# EAGLE design 8relays (EAGLE 6.4)
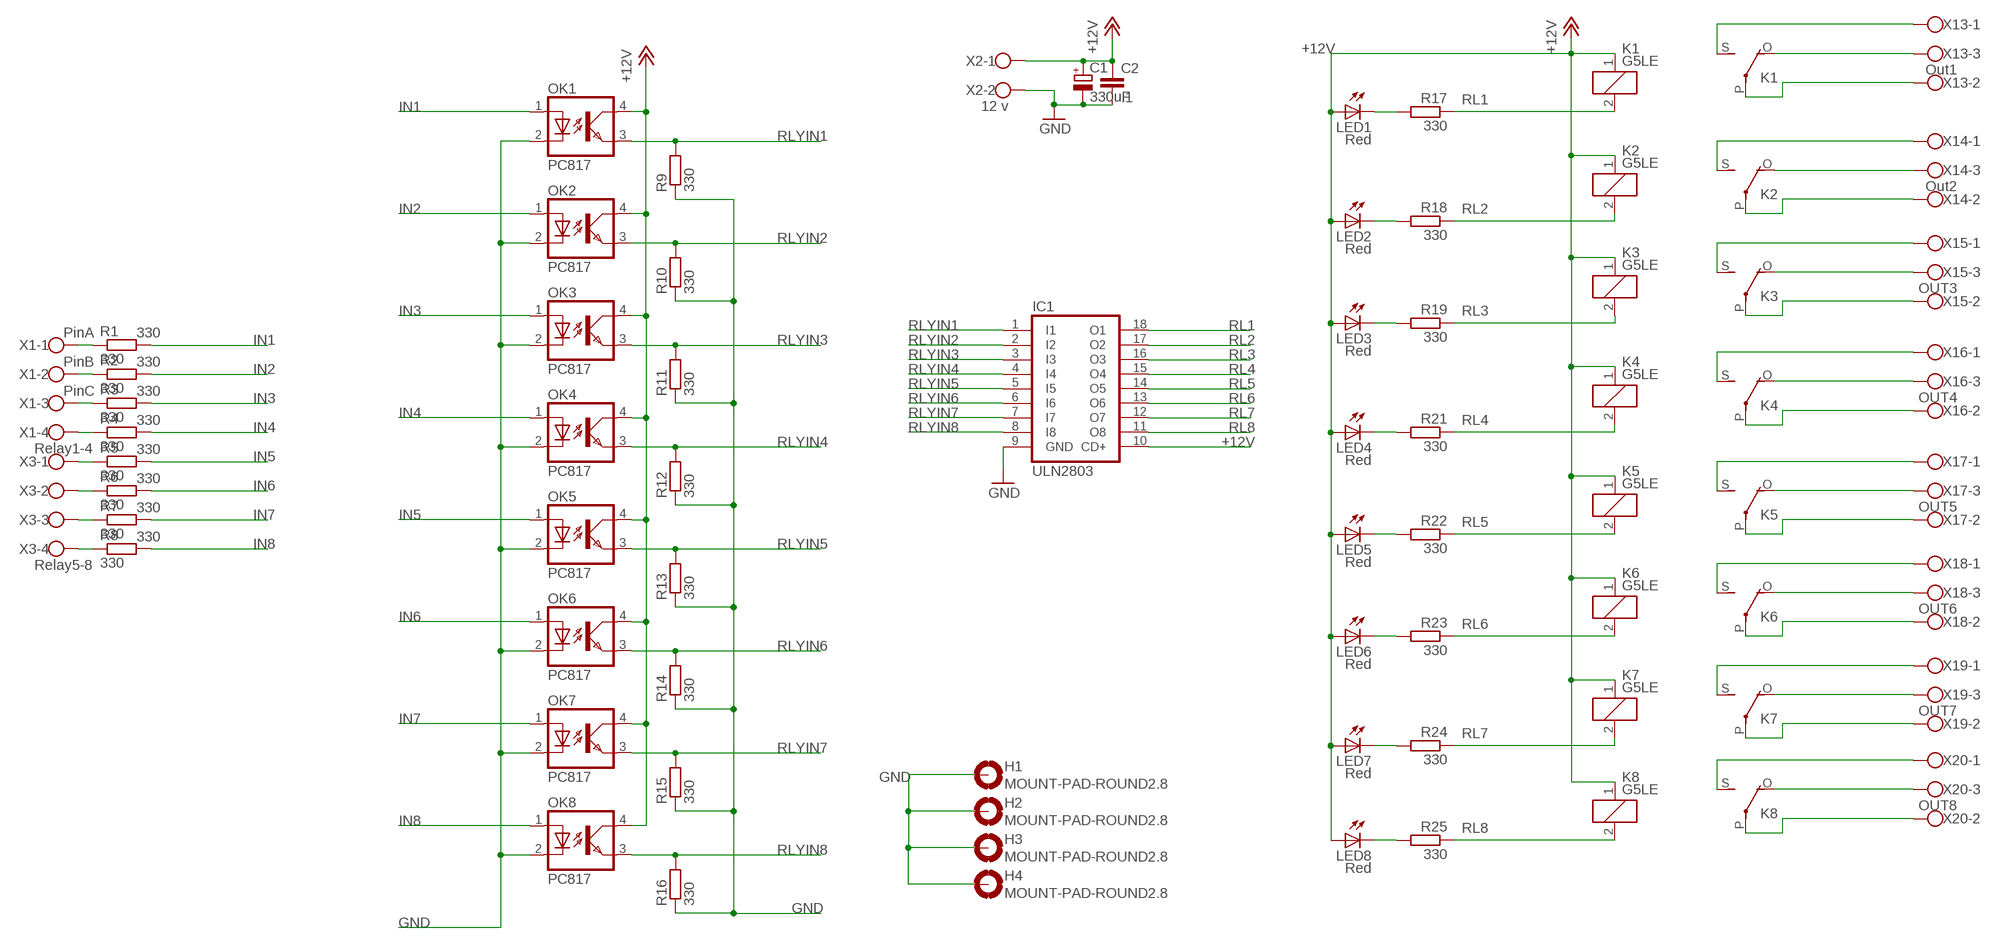
[diagram p0: schematic, sheet 1]

## Parts
C1  330uF  CPOL-EUE5-10.5  [E5-10,5]
C2  .1  C5/2.5  [C5B2.5]
H1  MOUNT-PAD-ROUND2.8  [2,8-PAD]
H2  MOUNT-PAD-ROUND2.8  [2,8-PAD]
H3  MOUNT-PAD-ROUND2.8  [2,8-PAD]
H4  MOUNT-PAD-ROUND2.8  [2,8-PAD]
IC1  ULN2803  ULN2803A  [DIL18]
K1  G5LE  [G5LE]
K2  G5LE  [G5LE]
K3  G5LE  [G5LE]
K4  G5LE  [G5LE]
K5  G5LE  [G5LE]
K6  G5LE  [G5LE]
K7  G5LE  [G5LE]
K8  G5LE  [G5LE]
LED1  Red  LED3MM  [LED3MM]
LED2  Red  LED3MM  [LED3MM]
LED3  Red  LED3MM  [LED3MM]
LED4  Red  LED3MM  [LED3MM]
LED5  Red  LED3MM  [LED3MM]
LED6  Red  LED3MM  [LED3MM]
LED7  Red  LED3MM  [LED3MM]
LED8  Red  LED3MM  [LED3MM]
OK1  PC817  [DIL04]
OK2  PC817  [DIL04]
OK3  PC817  [DIL04]
OK4  PC817  [DIL04]
OK5  PC817  [DIL04]
OK6  PC817  [DIL04]
OK7  PC817  [DIL04]
OK8  PC817  [DIL04]
R1  330  R-EU_0204/5  [0204/5]
R2  330  R-EU_0204/5  [0204/5]
R3  330  R-EU_0204/5  [0204/5]
R4  330  R-EU_0204/5  [0204/5]
R5  330  R-EU_0204/5  [0204/5]
R6  330  R-EU_0204/5  [0204/5]
R7  330  R-EU_0204/5  [0204/5]
R8  330  R-EU_0204/5  [0204/5]
R9  330  R-EU_0204/5  [0204/5]
R10  330  R-EU_0204/5  [0204/5]
R11  330  R-EU_0204/5  [0204/5]
R12  330  R-EU_0204/5  [0204/5]
R13  330  R-EU_0204/5  [0204/5]
R14  330  R-EU_0204/5  [0204/5]
R15  330  R-EU_0204/5  [0204/5]
R16  330  R-EU_0204/5  [0204/5]
R17  330  R-EU_0204/5  [0204/5]
R18  330  R-EU_0204/5  [0204/5]
R19  330  R-EU_0204/5  [0204/5]
R21  330  R-EU_0204/5  [0204/5]
R22  330  R-EU_0204/5  [0204/5]
R23  330  R-EU_0204/5  [0204/5]
R24  330  R-EU_0204/5  [0204/5]
R25  330  R-EU_0204/5  [0204/5]
X1  Relay1-4  W237-4  [W237-4]
X2  12 v  W237-102  [W237-102]
X3  Relay5-8  W237-4  [W237-4]
X13  Out1  W237-103  [W237-103]
X14  Out2  W237-103  [W237-103]
X15  OUT3  W237-103  [W237-103]
X16  OUT4  W237-103  [W237-103]
X17  OUT5  W237-103  [W237-103]
X18  OUT6  W237-103  [W237-103]
X19  OUT7  W237-103  [W237-103]
X20  OUT8  W237-103  [W237-103]

## Nets
+12V: C1.+ C2.1 IC1.10(CD+) K1.1 K2.1 K3.1 K4.1 K5.1 K6.1 K7.1 K8.1 LED1.A LED2.A LED3.A LED4.A LED5.A LED6.A LED7.A LED8.A OK1.4(COL) OK2.4(COL) OK3.4(COL) OK4.4(COL) OK5.4(COL) OK6.4(COL) OK7.4(COL) OK8.4(COL) X2.1
GND: C1.- C2.2 H1.B2,8(MOUNT) H2.B2,8(MOUNT) H3.B2,8(MOUNT) H4.B2,8(MOUNT) IC1.9(GND) OK1.2(C) OK2.2(C) OK3.2(C) OK4.2(C) OK5.2(C) OK6.2(C) OK7.2(C) OK8.2(C) R9.1 R10.1 R11.1 R12.1 R13.1 R14.1 R15.1 R16.1 X2.2
IN1: OK1.1(A) R1.2
IN2: OK2.1(A) R2.2
IN3: OK3.1(A) R3.2
IN4: OK4.1(A) R4.2
IN5: OK5.1(A) R5.2
IN6: OK6.1(A) R6.2
IN7: OK7.1(A) R7.2
IN8: OK8.1(A) R8.2
N$1: R1.1 X1.1
N$2: LED5.K(C) R22.2
N$3: K1.O(2:O) X13.3
N$4: K1.P(2:P) X13.2
N$5: R4.1 X1.4
N$6: K1.S(2:S) X13.1
N$7: R5.1 X3.1
N$8: R6.1 X3.2
N$9: R2.1 X1.2
N$10: R3.1 X1.3
N$11: K2.S(2:S) X14.1
N$12: K2.O(2:O) X14.3
N$13: K2.P(2:P) X14.2
N$14: K3.S(2:S) X15.1
N$15: K3.O(2:O) X15.3
N$16: K3.P(2:P) X15.2
N$17: K4.O(2:O) X16.3
N$18: K5.O(2:O) X17.3
N$19: K6.O(2:O) X18.3
N$20: R7.1 X3.3
N$21: LED1.K(C) R17.2
N$22: K7.O(2:O) X19.3
N$23: K8.O(2:O) X20.3
N$24: R8.1 X3.4
N$25: LED8.K(C) R25.2
N$26: LED7.K(C) R24.2
N$27: LED6.K(C) R23.2
N$28: LED4.K(C) R21.2
N$29: LED3.K(C) R19.2
N$30: LED2.K(C) R18.2
N$31: K8.P(2:P) X20.2
N$32: K8.S(2:S) X20.1
N$33: K7.P(2:P) X19.2
N$34: K7.S(2:S) X19.1
N$35: K6.P(2:P) X18.2
N$36: K6.S(2:S) X18.1
N$37: K5.P(2:P) X17.2
N$38: K5.S(2:S) X17.1
N$39: K4.P(2:P) X16.2
N$40: K4.S(2:S) X16.1
RL1: IC1.18(O1) K1.2 R17.1
RL2: IC1.17(O2) K2.2 R18.1
RL3: IC1.16(O3) K3.2 R19.1
RL4: IC1.15(O4) K4.2 R21.1
RL5: IC1.14(O5) K5.2 R22.1
RL6: IC1.13(O6) K6.2 R23.1
RL7: IC1.12(O7) K7.2 R24.1
RL8: IC1.11(O8) K8.2 R25.1
RLYIN1: IC1.1(I1) OK1.3(EMIT) R9.2
RLYIN2: IC1.2(I2) OK2.3(EMIT) R10.2
RLYIN3: IC1.3(I3) OK3.3(EMIT) R11.2
RLYIN4: IC1.4(I4) OK4.3(EMIT) R12.2
RLYIN5: IC1.5(I5) OK5.3(EMIT) R13.2
RLYIN6: IC1.6(I6) OK6.3(EMIT) R14.2
RLYIN7: IC1.7(I7) OK7.3(EMIT) R15.2
RLYIN8: IC1.8(I8) OK8.3(EMIT) R16.2

## Notes on the sheet
- PinA | 330
- PinB | 330
- PinC | 330
- 330
- 330
- 330
- 330
- 330

## Library data of the parts
C1 = rcl:CPOL-EU: POLARIZED CAPACITOR, European symbol
C2 = capacitor-wima:C: CAPACITOR naming: grid - package width
H1-H4 = holes:MOUNT-PAD-ROUND: MOUNTING PAD, round
IC1 = uln-udn:ULN2803A: DRIVER ARRAY
K1-K8 = relay:G5LE: RELAY 1 x switch, 10 A/120 V AC, 8 A/30 V DC, Omron
LED1-LED8 = adafruit:LED: LED OSRAM: - CHIPLED LG R971, LG N971, LY N971, LG Q971, LY Q971, LO R971, LY R971 LH N974, LH R974 LS Q976, LO Q976, LY Q976 LO Q996 - Hyper CHIPLED LW Q18S LB Q993, LB Q99A, LB R99A - SideLED LS A670, LO A670, LY A670, LG A670, LP A670 LB A673, LV A673, LT A673, LW A673 LH A674 LY A675 LS A676, LA A676, LO A676, LY A676, LW A676 LS A679, LY A679, LG A679 - Hyper Micro SIDELED® LS Y876, LA Y876, LO Y876, LY Y876 LT Y87S - SmartLED LW L88C, LW L88S LB L89C, LB L89S, LG L890 LS L89K, LO L89K, LY L89K LS L896, LA L896, LO L896, LY L896 - TOPLED LS T670, LO T670, LY T670, LG T670, LP T670 LSG T670, LSP T670, LSY T670, LOP T670, LYG T670 LG T671, LOG T671, LSG T671 LB T673, LV T673, LT T673, LW T673 LH T674 LS T676, LA T676, LO T676, LY T676, LB T676, LH T676, LSB T676, LW T676 LB T67C, LV T67C, LT T67C, LS T67K, LO T67K, LY T67K, LW E67C LS E67B, LA E67B, LO E67B, LY E67B, LB E67C, LV E67C, LT E67C LW T67C LS T679, LY T679, LG T679 LS T770, LO T770, LY T770, LG T770, LP T770 LB T773, LV T773, LT T773, LW T773 LH T774 LS E675, LA E675, LY E675, LS T675 LS T776, LA T776, LO T776, LY T776, LB T776 LHGB T686 LT T68C, LB T68C - Hyper Mini TOPLED® LB M676 - Mini TOPLED Santana® LG M470 LS M47K, LO M47K, LY M47K Source: http://www.osram.convergy.de/
OK1-OK8 = optocoupler:PC817: SHARP OPTO COUPLER
R1-R19 R21-R25 = resistor:R-EU_: RESISTOR, European symbol
X1 X3 = con-wago-500:W237-4: WAGO SCREW CLAMP; OC_FARNELL: unknown; OC_NEWARK: unknown
X2 = con-wago-500:W237-102: WAGO SCREW CLAMP; MPN: 237-102; OC_FARNELL: unknown; OC_NEWARK: 70K9898
X13-X20 = con-wago-500:W237-103: WAGO SCREW CLAMP; MPN: 237-103; OC_FARNELL: unknown; OC_NEWARK: 18M7116

## Net classes
0 default: width 0.356 mm
1 line: width 1.016 mm

## Board
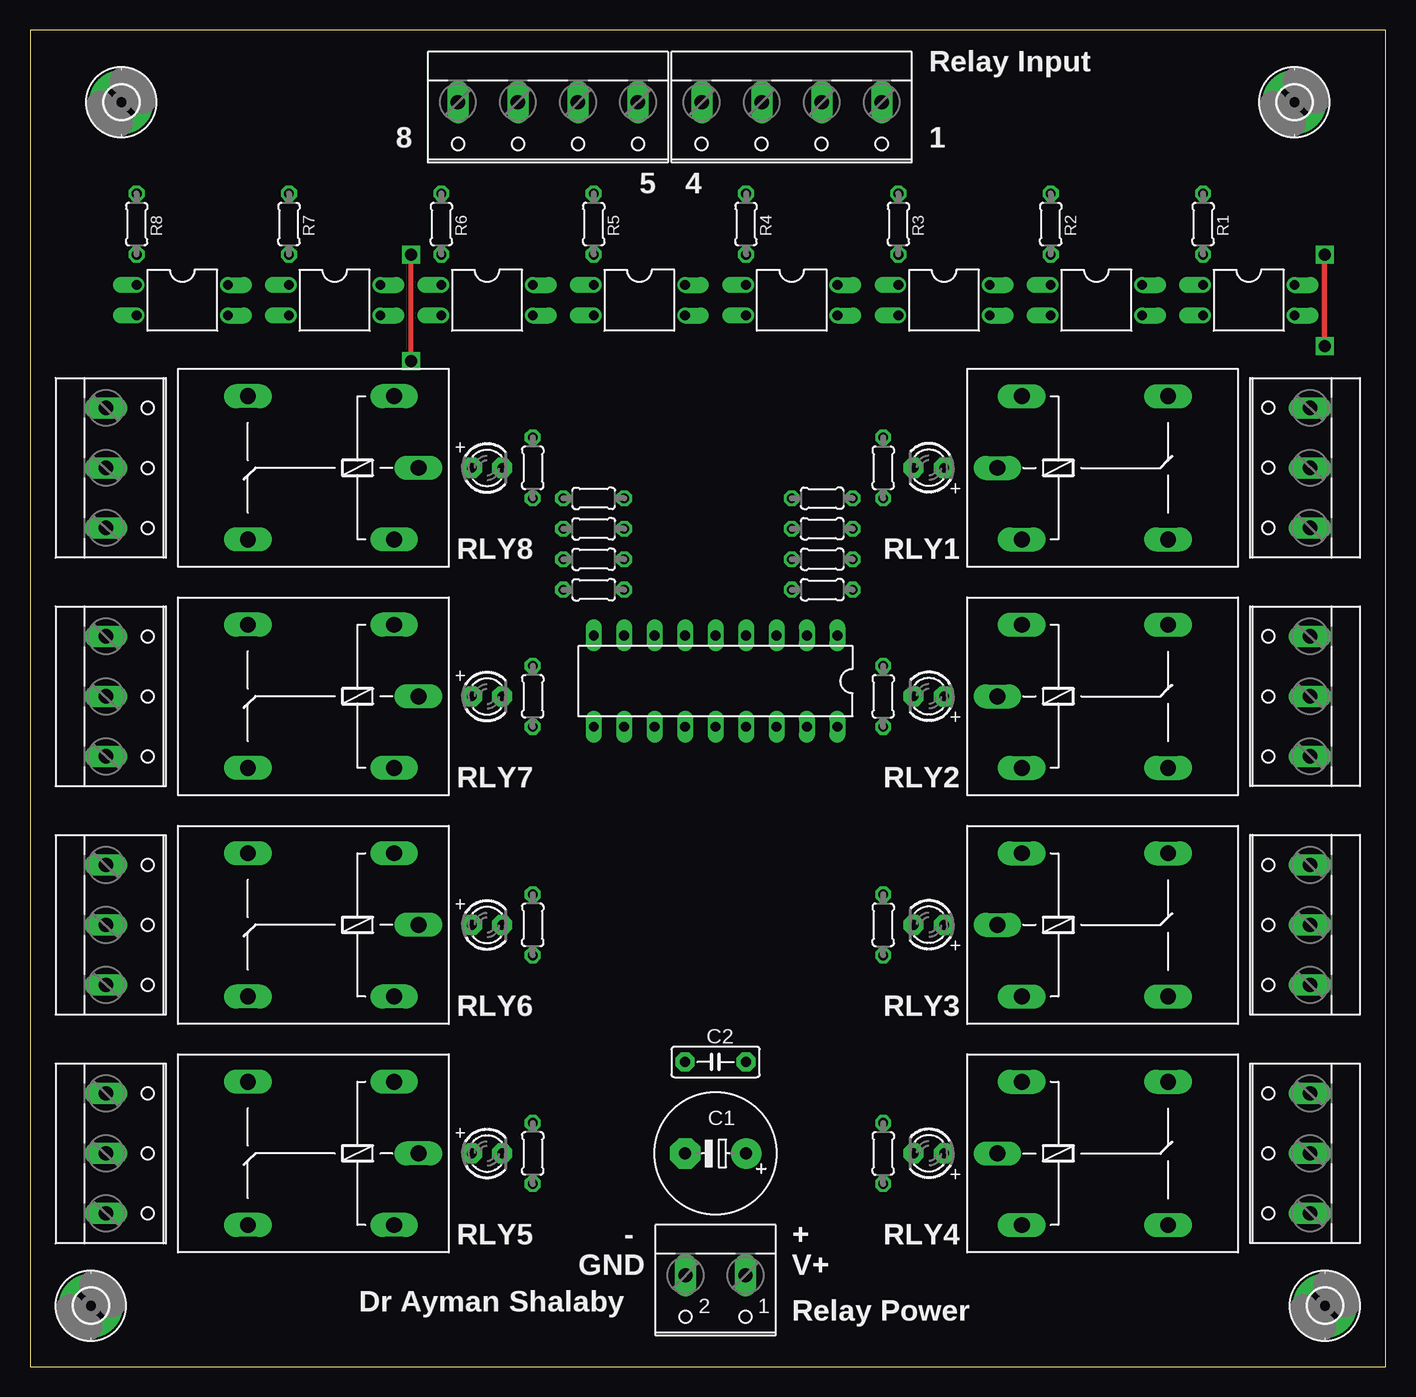
[diagram p1: board, top side]
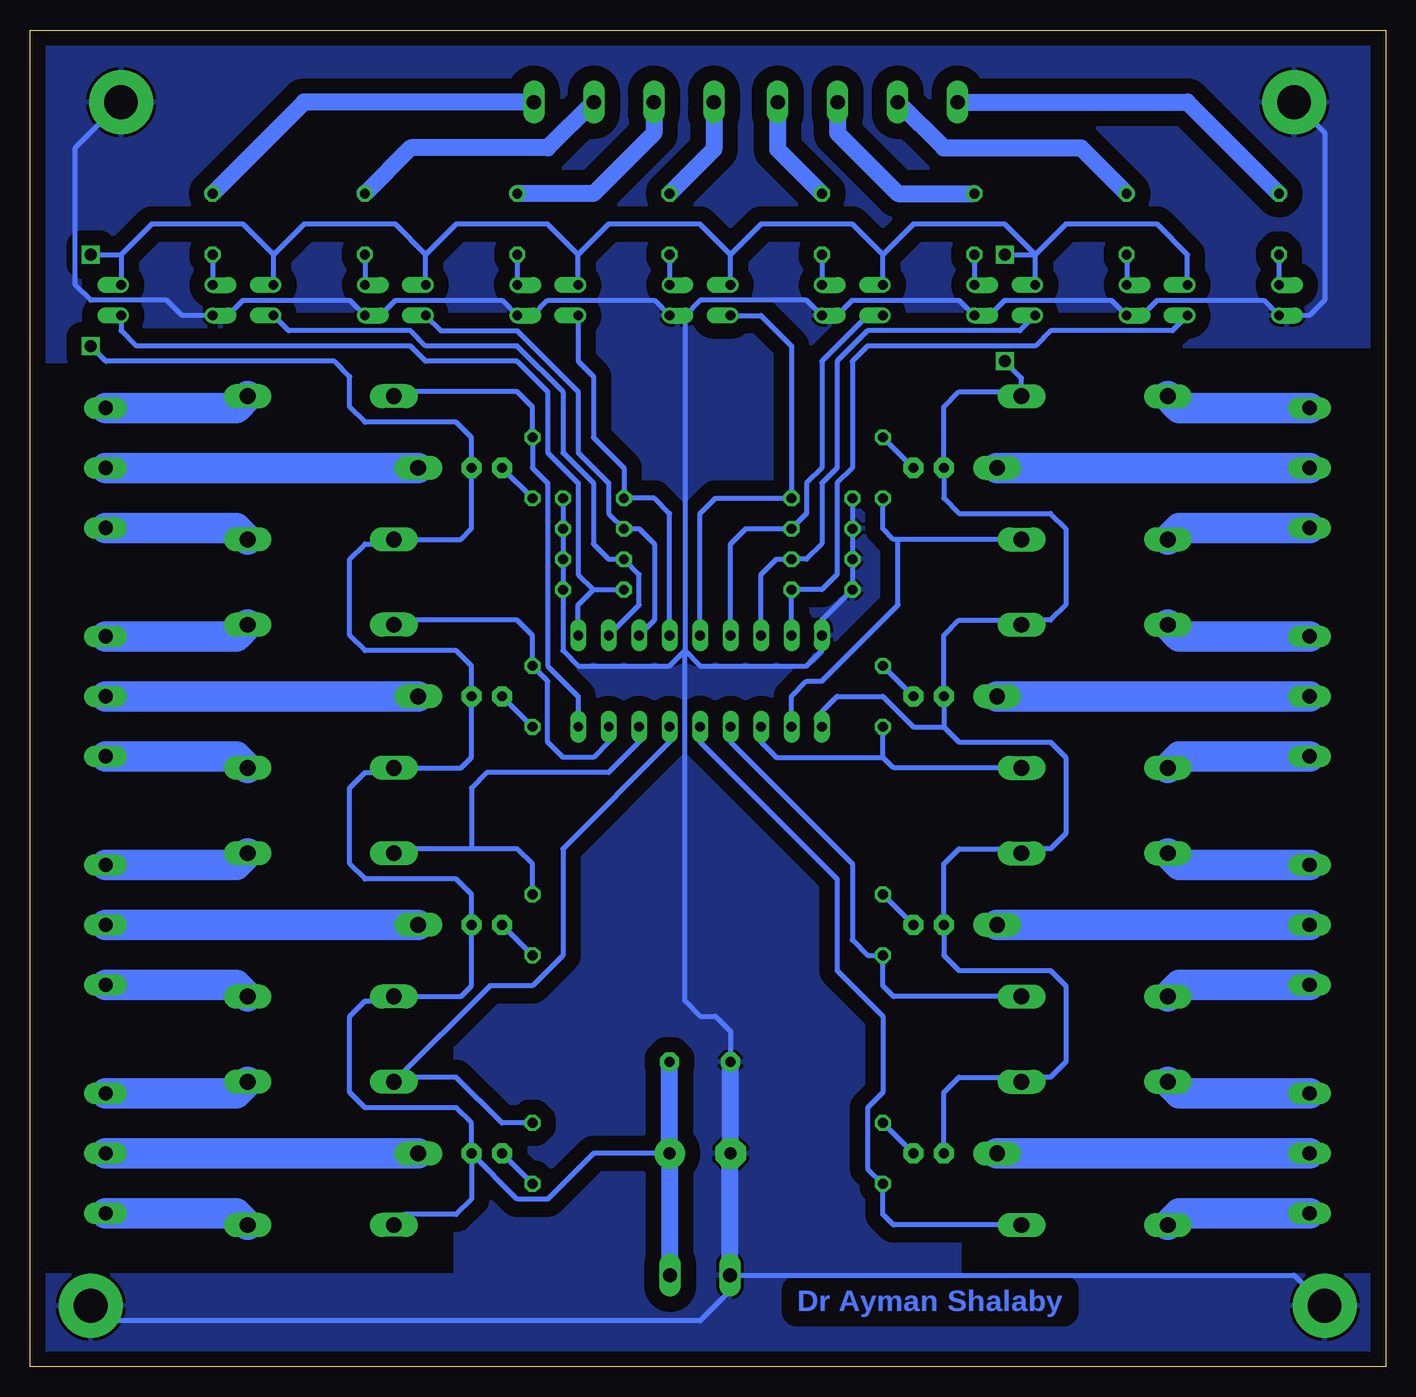
[diagram p2: board, bottom side, seen from below]

Size 113.01 x 111.43 mm. Coordinates in mm from the lower left corner, seen from the top.
Outline: 0,0 113.01,0 113.01,111.43 0,111.43 0,0
Copper layers (1*16): Top 0.035mm / dielectric 1.5mm / Bottom 0.035mm
Design rules "default": minimum track width 10mil, minimum drill 24mil, track to track 8mil, track to pad 8mil, pad to pad 8mil, via to via 8mil, smd to smd 8mil, copper to edge 40mil, drill to drill 8mil, minimum pad ring 10mil, minimum via ring 8mil, stop-mask expansion 4mil, vias tented up to drill 0mil, thermal gap 10mil

### Footprints (pad centres in the part's own frame; a part is rotated, then mirrored left to right if it is on the bottom)
E5-10,5 = drill 1.016 pad 2.54: + -2.54,0 | drill 1.016 pad 2.54 octagon: - 2.54,0
C5B2.5 = drill 0.813 pad 1.6 octagon: 1 -2.54,0; 2 2.54,0
2,8-PAD = drill 2.8 pad 5.334: B2,8 0,0
DIL18 = drill 0.813 long: 1 -10.16,-3.81; 2 -7.62,-3.81; 3 -5.08,-3.81; 4 -2.54,-3.81; 5 0,-3.81; 6 2.54,-3.81; 7 5.08,-3.81; 8 7.62,-3.81; 9 10.16,-3.81; 10 10.16,3.81; 11 7.62,3.81; 12 5.08,3.81; 13 2.54,3.81; 14 0,3.81; 15 -2.54,3.81; 16 -5.08,3.81; 17 -7.62,3.81; 18 -10.16,3.81
G5LE = drill 1.321 long: 1 -7.493,-5.969; 2 -7.493,5.969; O 4.699,5.969; P -9.525,0; S 4.699,-5.969
LED3MM = drill 0.813 pad 1.676 octagon: A -1.27,0; K 1.27,0
DIL04 = drill 0.813 offset: 1 -1.27,-3.81; 2 1.27,-3.81; 3 1.27,3.81; 4 -1.27,3.81
0204/5 = drill 0.813 octagon: 1 -2.54,0; 2 2.54,0
W237-4 = drill 1.194 long: 1 -7.5,-1.27; 2 -2.5,-1.27; 3 2.5,-1.27; 4 7.5,-1.27
W237-102 = drill 1.194 long: 1 -2.5,-1.27; 2 2.5,-1.27
W237-103 = drill 1.194 long: 1 -5,-1.29; 2 0,-1.29; 3 5,-1.29

### Placement (x,y rotation side)
C1  57.15,17.78 180 top
C2  57.15,25.4 180 top
H1  5.08,5.08 0 top
H2  107.95,5.08 0 top
H3  105.41,105.41 0 top
H4  7.62,105.41 0 top
IC1  57.15,57.15 180 top
K1  90.17,74.93 0 top
K2  90.17,55.88 0 top
K3  90.17,36.83 0 top
K4  90.17,17.78 0 top
K5  22.86,17.78 180 top
K6  22.86,36.83 180 top
K7  22.86,55.88 180 top
K8  22.86,74.93 180 top
LED1  74.93,74.93 180 top
LED2  74.93,55.88 180 top
LED3  74.93,36.83 180 top
LED4  74.93,17.78 180 top
LED5  38.1,17.78 0 top
LED6  38.1,36.83 0 top
LED7  38.1,55.88 0 top
LED8  38.1,74.93 0 top
OK1  101.6,88.9 270 top
OK2  88.9,88.9 270 top
OK3  76.2,88.9 270 top
OK4  63.5,88.9 270 top
OK5  50.8,88.9 270 top
OK6  38.1,88.9 270 top
OK7  25.4,88.9 270 top
OK8  12.7,88.9 270 top
R1  97.79,95.25 270 top
R2  85.09,95.25 270 top
R3  72.39,95.25 270 top
R4  59.69,95.25 270 top
R5  46.99,95.25 270 top
R6  34.29,95.25 270 top
R7  21.59,95.25 270 top
R8  8.89,95.25 270 top
R9  66.04,64.77 180 top
R10  66.04,67.31 180 top
R11  66.04,69.85 180 top
R12  66.04,72.39 180 top
R13  46.99,72.39 0 top
R14  46.99,69.85 0 top
R15  46.99,67.31 0 top
R16  46.99,64.77 0 top
R17  71.12,74.93 270 top
R18  71.12,55.88 270 top
R19  71.12,36.83 270 top
R21  71.12,17.78 270 top
R22  41.91,17.78 90 top
R23  41.91,36.83 90 top
R24  41.91,55.88 90 top
R25  41.91,74.93 90 top
X1  63.5,104.14 180 top
X2  57.15,6.35 180 top
X3  43.18,104.14 180 top
X13  105.41,74.93 90 top
X14  105.41,55.88 90 top
X15  105.41,36.83 90 top
X16  105.41,17.78 90 top
X17  7.62,17.78 270 top
X18  7.62,36.83 270 top
X19  7.62,55.88 270 top
X20  7.62,74.93 270 top

### Tracks (layer width: path | path; a pad name or v marks a point on that pad's centre or on a via)
+12V  (via drill 1)
  Top 0.406: v31.75,83.82 v31.75,92.71 | v107.95,85.09 v107.95,92.71
  Bottom 0.406: OK8.4 16.51,92.71 19.05,95.25 26.67,95.25 29.21,92.71 | OK7.4 29.21,92.71 | 29.21,92.71 31.75,95.25 39.37,95.25 41.91,92.71 | OK6.4 41.91,92.71 | 41.91,92.71 44.45,95.25 52.07,95.25 54.61,92.71 | OK5.4 54.61,92.71 | 54.61,92.71 57.15,95.25 64.77,95.25 67.31,92.71 | OK4.4 67.31,92.71 | 67.31,92.71 69.85,95.25 77.47,95.25 80.01,92.71 | OK3.4 80.01,92.71 | 80.01,92.71 82.55,95.25 90.17,95.25 92.71,92.71 | OK2.4 92.71,92.71 | 92.71,92.71 95.25,95.25 102.87,95.25 105.41,92.71 | 105.41,92.71 OK1.4 | v31.75,83.82 30.35,82.42 K8.1 30.73,81.28 35.56,81.28 36.83,80.01 LED8.A 36.83,72.39 35.56,71.12 27.94,71.12 26.67,69.85 26.67,63.5 27.94,62.23 29.97,62.23 K7.1 30.73,62.23 35.56,62.23 36.83,60.96 LED7.A 36.83,53.34 | v31.75,92.71 29.21,92.71 | LED4.A 76.2,13.97 77.47,12.7 81.79,12.7 K4.1 | LED5.A 36.83,22.86 35.56,24.13 30.73,24.13 K5.1 29.97,24.13 27.94,24.13 26.67,25.4 26.67,31.75 27.94,33.02 35.56,33.02 36.83,34.29 LED6.A 36.83,41.91 35.56,43.18 30.73,43.18 K6.1 29.97,43.18 27.94,43.18 26.67,44.45 26.67,50.8 27.94,52.07 35.56,52.07 36.83,53.34 | v107.95,85.09 106.68,83.82 87.63,83.82 86.36,82.55 86.36,80.01 85.09,78.74 77.47,78.74 76.2,77.47 LED1.A 76.2,69.85 77.09,68.96 K1.1 82.55,68.83 82.55,68.58 85.09,68.58 86.36,67.31 86.36,60.96 85.09,59.69 77.47,59.69 76.2,58.42 LED2.A 76.2,50.8 77.09,49.91 K2.1 83.06,49.53 85.09,49.53 86.36,48.26 86.36,41.91 85.09,40.64 77.47,40.64 76.2,39.37 LED3.A 76.2,31.75 77.09,30.86 K3.1 83.06,30.48 85.09,30.48 86.36,29.21 86.36,22.86 85.09,21.59 77.47,21.59 76.2,20.32 LED4.A | v107.95,92.71 105.41,92.71 | IC1.10 46.99,54.61 45.72,55.88 41.91,55.88 39.37,53.34 36.83,53.34
  Bottom 0.406: C1.+ 66.04,17.78 69.85,13.97 72.39,13.97 LED4.A
  Bottom 1.422: X2.1 59.69,7.66 C1.+ C2.1
GND
  Bottom 0.406: 58.42,87.63 OK4.2 60.96,88.9 69.85,88.9 71.12,87.63 OK3.2 73.66,88.9 82.55,88.9 83.82,87.63 OK2.2 86.36,88.9 95.25,88.9 96.52,87.63 OK1.2 100.33,87.63 101.6,88.9 107.95,88.9 109.22,90.17 109.22,101.6 H3.B2,8 | R12.1 R11.1 R10.1 R9.1 68.58,59.69 67.31,58.42 59.69,58.42 58.42,59.69 | R13.1 R14.1 R15.1 R16.1 46.99,62.23 IC1.9 46.99,59.69 48.26,58.42 57.15,58.42 58.42,59.69 | H4.B2,8 5.08,102.87 5.08,88.9 6.35,87.63 OK8.2 10.16,88.9 19.05,88.9 20.32,87.63 OK7.2 22.86,88.9 31.75,88.9 33.02,87.63 OK6.2 35.56,88.9 44.45,88.9 45.72,87.63 OK5.2 48.26,88.9 57.15,88.9 58.42,87.63 | 58.42,87.63 58.42,59.69 | 58.42,59.69 58.42,30.48 57.15,29.21 55.88,29.21 54.61,27.94 C2.2 | H1.B2,8 7.62,7.62 X2.2 54.65,6.31 57.15,3.81 106.68,3.81 H2.B2,8
  Bottom 1.422: X2.2 54.65,17.74 C1.- C2.2
  pour Bottom (isolate 1.27): 113.03,111.76 0,111.76 0,85.09 35.56,85.09 35.56,7.62 0,7.62 0,0 113.03,0 113.03,7.62 77.47,7.62 77.47,83.82 113.03,83.82
IN1
  Bottom 0.406: R1.2 OK1.1
IN2
  Bottom 0.406: R2.2 OK2.1
IN3
  Bottom 0.406: R3.2 OK3.1
IN4
  Bottom 0.406: R4.2 OK4.1
IN5
  Bottom 0.406: R5.2 OK5.1
IN6
  Bottom 0.406: R6.2 OK6.1
IN7
  Bottom 0.406: R7.2 OK7.1
IN8
  Bottom 0.406: R8.2 OK8.1
N$1
  Bottom 1.422: X1.1 90.17,105.41 R1.1
N$2
  Bottom 0.406: R22.2 LED5.K
N$3
  Bottom 2.54: X13.3 95.84,79.93 K1.O
N$4
  Bottom 2.54: X13.2 K1.P
N$5
  Bottom 1.422: X1.4 56,101.48 R4.1
N$6
  Bottom 2.54: X13.1 95.84,69.93 K1.S
N$7
  Bottom 1.422: X3.1 50.68,101.48 R5.1
N$8
  Bottom 1.422: X3.2 45.68,102.83 40.64,97.79 R6.1
N$9
  Bottom 1.422: X1.2 66.04,105.41 69.85,101.6 81.28,101.6 R2.1
N$10
  Bottom 1.422: X1.3 61,102.83 66.04,97.79 R3.1
N$11
  Bottom 2.54: X14.1 95.84,50.88 K2.S
N$12
  Bottom 2.54: X14.3 95.84,60.88 K2.O
N$13
  Bottom 2.54: X14.2 K2.P
N$14
  Bottom 2.54: X15.1 95.84,31.83 K3.S
N$15
  Bottom 2.54: X15.3 95.84,41.83 K3.O
N$16
  Bottom 2.54: X15.2 K3.P
N$17
  Bottom 2.54: X16.3 95.84,22.78 K4.O
N$18
  Bottom 2.54: X17.3 17.19,12.78 K5.O
N$19
  Bottom 2.54: X18.3 17.19,31.83 K6.O
N$20
  Bottom 1.422: X3.3 40.64,105.41 36.83,101.6 25.4,101.6 R7.1
N$21
  Bottom 0.406: LED1.K R17.2
N$22
  Bottom 2.54: X19.3 17.19,50.88 K7.O
N$23
  Bottom 2.54: X20.3 17.19,69.93 K8.O
N$24
  Bottom 1.422: X3.4 16.51,105.41 R8.1
N$25
  Bottom 0.406: R25.2 LED8.K
N$26
  Bottom 0.406: R24.2 LED7.K
N$27
  Bottom 0.406: R23.2 LED6.K
N$28
  Bottom 0.406: R21.2 LED4.K
N$29
  Bottom 0.406: LED3.K R19.2
N$30
  Bottom 0.406: LED2.K R18.2
N$31
  Bottom 2.54: K8.P X20.2
N$32
  Bottom 2.54: X20.1 17.19,79.93 K8.S
N$33
  Bottom 2.54: K7.P X19.2
N$34
  Bottom 2.54: X19.1 17.19,60.88 K7.S
N$35
  Bottom 2.54: X18.2 K6.P
N$36
  Bottom 2.54: X18.1 17.19,41.83 K6.S
N$37
  Bottom 2.54: X17.2 K5.P
N$38
  Bottom 2.54: X17.1 17.19,22.78 K5.S
N$39
  Bottom 2.54: X16.2 K4.P
N$40
  Bottom 2.54: X16.1 95.84,12.78 K4.S
RL1
  Bottom 0.406: K1.2 82.3,81.28 72.39,81.28 71.12,80.01 R17.1 71.12,74.93 69.85,73.66 69.85,58.42 67.31,55.88 IC1.18
RL2
  Bottom 0.406: K2.2 82.3,62.23 72.39,62.23 71.12,60.96 R18.1 69.85,57.15 69.85,52.07 68.58,50.8 66.04,50.8 64.77,52.07 IC1.17
RL3
  Bottom 0.406: R19.1 71.12,41.91 72.39,43.18 76.2,43.18 | 76.2,43.18 82.3,43.18 K3.2 | IC1.16 62.23,52.07 64.77,49.53 74.93,49.53 76.2,48.26 76.2,43.18
RL4
  Bottom 0.406: IC1.15 59.69,52.07 68.58,43.18 68.58,34.29 71.12,31.75 74.68,31.75 K4.2 82.3,24.13 77.47,24.13 73.66,20.32 R21.1
RL5
  Bottom 0.406: K5.2 41.02,11.81 41.91,12.7 R22.1 43.18,16.51 43.18,21.59 41.91,22.86 41.91,29.21 45.72,33.02 45.72,40.64 57.15,52.07 IC1.14
RL6
  Bottom 0.406: K6.2 41.02,30.86 41.91,31.75 R23.1 43.18,34.29 44.45,35.56 44.45,41.91 54.61,52.07 IC1.13
RL7
  Bottom 0.406: K7.2 41.02,49.91 41.91,50.8 | 41.91,50.8 R24.1 | IC1.12 52.07,52.07 50.8,50.8 41.91,50.8
RL8
  Bottom 0.406: K8.2 40.64,68.96 | 40.64,68.96 41.02,68.96 41.91,69.85 R25.1 | IC1.11 49.53,55.88 48.26,57.15 46.99,57.15 40.64,63.5 40.64,68.96
RLYIN1
  Bottom 0.406: OK1.3 105.41,86.36 104.14,85.09 81.28,85.09 80.01,83.82 72.39,83.82 69.85,81.28 69.85,76.2 67.31,73.66 67.31,66.04 66.04,64.77 | 66.04,64.77 R9.2 | IC1.1 67.31,63.5 66.04,64.77
RLYIN2
  Bottom 0.406: IC1.2 62.23,63.5 62.23,66.04 R10.2 64.77,67.31 66.04,68.58 66.04,73.66 68.58,76.2 68.58,81.28 72.39,85.09 80.01,85.09 81.28,86.36 91.44,86.36 OK2.3
RLYIN3
  Bottom 0.406: OK3.3 78.74,86.36 72.39,86.36 67.31,81.28 67.31,76.2 64.77,73.66 64.77,71.12 R11.2 62.23,69.85 60.96,68.58 60.96,62.23 IC1.3
RLYIN4
  Bottom 0.406: IC1.4 59.69,71.12 60.96,72.39 R12.2 63.5,74.93 66.04,77.47 66.04,82.55 67.31,83.82 OK4.3
RLYIN5
  Bottom 0.406: OK5.3 52.07,87.63 49.53,85.09 R13.2 55.88,72.39 57.15,71.12 IC1.5
RLYIN6
  Bottom 0.406: OK6.3 43.18,87.63 46.99,83.82 46.99,74.93 48.26,73.66 48.26,71.12 R14.2 53.34,69.85 54.61,68.58 IC1.6
RLYIN7
  Bottom 0.406: OK7.3 30.48,86.36 43.18,86.36 45.72,83.82 45.72,74.93 46.99,73.66 46.99,68.58 48.26,67.31 R15.2 50.8,67.31 52.07,66.04 IC1.7
RLYIN8
  Bottom 0.406: OK8.3 17.78,86.36 27.94,86.36 29.21,85.09 43.18,85.09 44.45,83.82 44.45,74.93 45.72,73.66 45.72,66.04 46.99,64.77 R16.2 IC1.8

### Text on the board
Bottom: Dr Ayman Shalaby
tPlace: Relay Input | 8 | 1 | 5 | 4 | RLY8 | RLY1 | RLY7 | RLY2 | RLY6 | RLY3 | RLY5 | - | + | RLY4 | GND | V+ | Dr Ayman Shalaby | Relay Power